# EAGLE schematic K019 (EAGLE 6.3), part 2 of 2
## Sheet 3 of 4
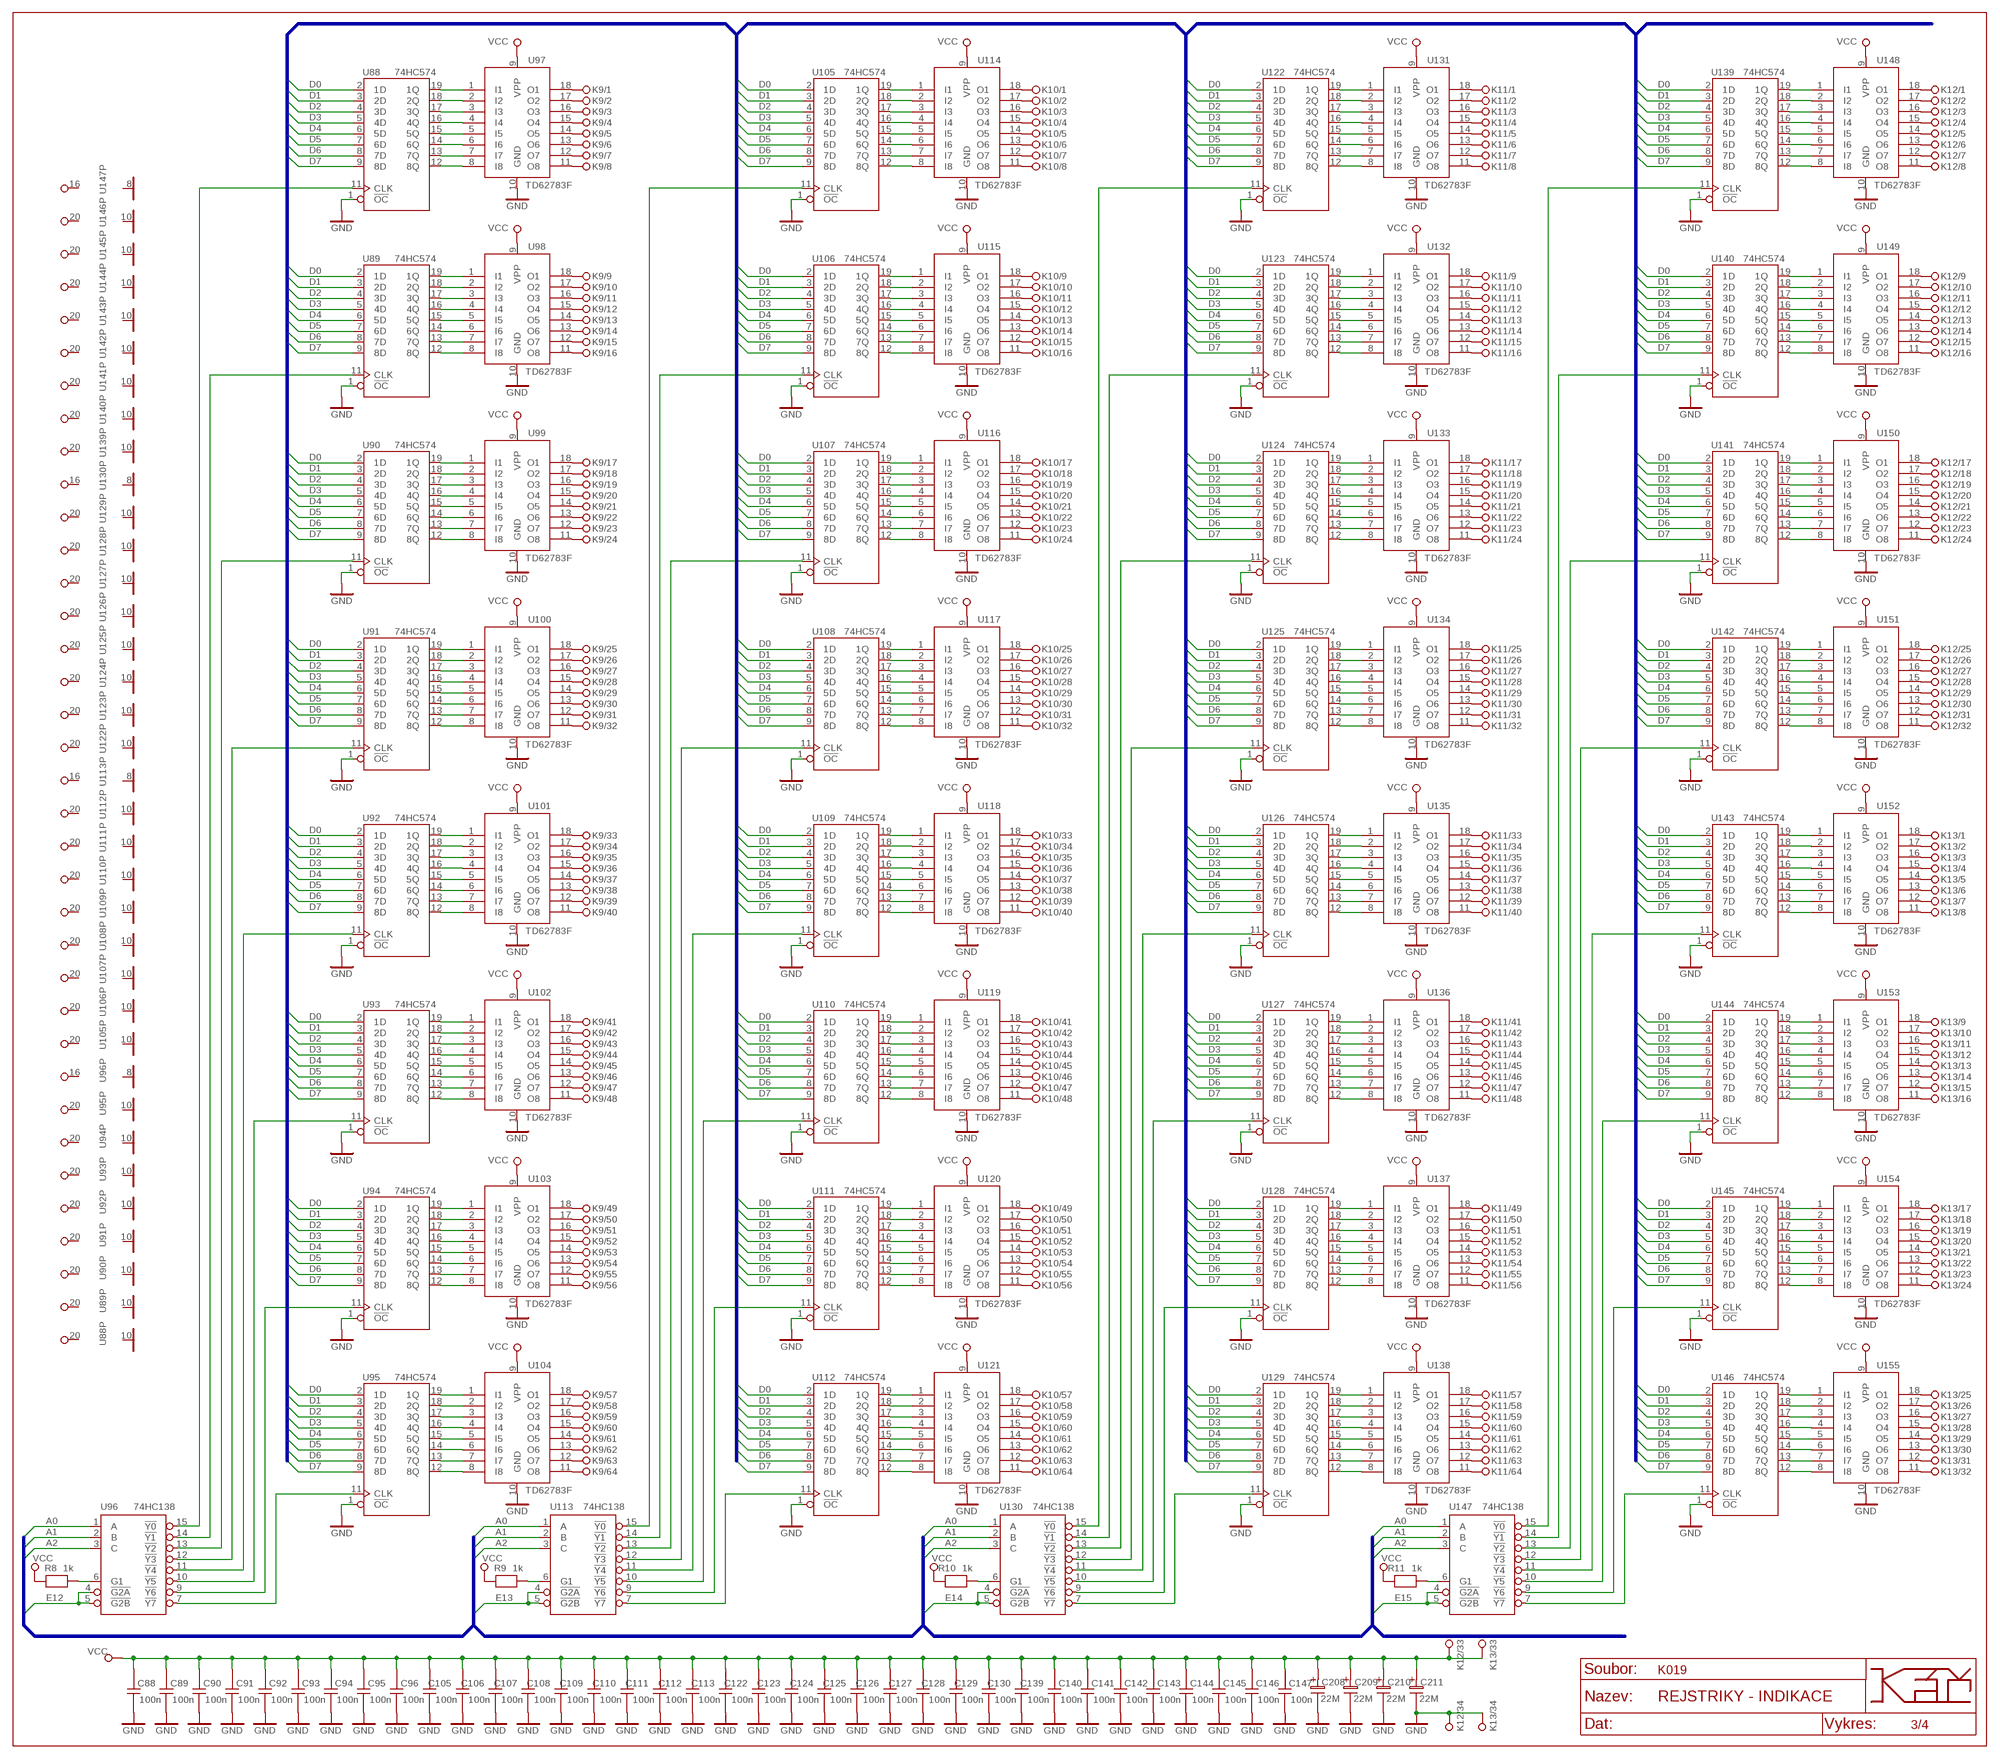
[diagram p3: schematic, sheet 3]

### Parts
C88  100n  C-5X8@2  [C-5-2X8]
C89  100n  C-5X8@2  [C-5-2X8]
C90  100n  C-5X8@2  [C-5-2X8]
C91  100n  C-5X8@2  [C-5-2X8]
C92  100n  C-5X8@2  [C-5-2X8]
C93  100n  C-5X8@2  [C-5-2X8]
C94  100n  C-5X8@2  [C-5-2X8]
C95  100n  C-5X8@2  [C-5-2X8]
C96  100n  C-5X8@2  [C-5-2X8]
C105  100n  C-5X8@2  [C-5-2X8]
C106  100n  C-5X8@2  [C-5-2X8]
C107  100n  C-5X8@2  [C-5-2X8]
C108  100n  C-5X8@2  [C-5-2X8]
C109  100n  C-5X8@2  [C-5-2X8]
C110  100n  C-5X8@2  [C-5-2X8]
C111  100n  C-5X8@2  [C-5-2X8]
C112  100n  C-5X8@2  [C-5-2X8]
C113  100n  C-5X8@2  [C-5-2X8]
C122  100n  C-5X8@2  [C-5-2X8]
C123  100n  C-5X8@2  [C-5-2X8]
C124  100n  C-5X8@2  [C-5-2X8]
C125  100n  C-5X8@2  [C-5-2X8]
C126  100n  C-5X8@2  [C-5-2X8]
C127  100n  C-5X8@2  [C-5-2X8]
C128  100n  C-5X8@2  [C-5-2X8]
C129  100n  C-5X8@2  [C-5-2X8]
C130  100n  C-5X8@2  [C-5-2X8]
C139  100n  C-5X8@2  [C-5-2X8]
C140  100n  C-5X8@2  [C-5-2X8]
C141  100n  C-5X8@2  [C-5-2X8]
C142  100n  C-5X8@2  [C-5-2X8]
C143  100n  C-5X8@2  [C-5-2X8]
C144  100n  C-5X8@2  [C-5-2X8]
C145  100n  C-5X8@2  [C-5-2X8]
C146  100n  C-5X8@2  [C-5-2X8]
C147  100n  C-5X8@2  [C-5-2X8]
C208  22M  EC-2/5  [EC-2/5]
C209  22M  EC-2/5  [EC-2/5]
C210  22M  EC-2/5  [EC-2/5]
C211  22M  EC-2/5  [EC-2/5]
K9  KON64  [KON64]
K10  KON64  [KON64]
K11  KON64  [KON64]
K12  KON34  [KON34]
K13  KON34  [KON34]
R8  1k  R-10-0,8@2  [R-7,5]
R9  1k  R-10-0,8@2  [R-7,5]
R10  1k  R-10-0,8@2  [R-7,5]
R11  1k  R-10-0,8@2  [R-7,5]
U88  74HC574  74AC574@2  [DIL20]
U89  74HC574  74AC574@2  [DIL20]
U90  74HC574  74AC574@2  [DIL20]
U91  74HC574  74AC574@2  [DIL20]
U92  74HC574  74AC574@2  [DIL20]
U93  74HC574  74AC574@2  [DIL20]
U94  74HC574  74AC574@2  [DIL20]
U95  74HC574  74AC574@2  [DIL20]
U96  74HC138  74AC138  [DIL16]
U97  TD62783F  TD62783F@2  [DIL18]
U98  TD62783F  TD62783F@2  [DIL18]
U99  TD62783F  TD62783F@2  [DIL18]
U100  TD62783F  TD62783F@2  [DIL18]
U101  TD62783F  TD62783F@2  [DIL18]
U102  TD62783F  TD62783F@2  [DIL18]
U103  TD62783F  TD62783F@2  [DIL18]
U104  TD62783F  TD62783F@2  [DIL18]
U105  74HC574  74AC574@2  [DIL20]
U106  74HC574  74AC574@2  [DIL20]
U107  74HC574  74AC574@2  [DIL20]
U108  74HC574  74AC574@2  [DIL20]
U109  74HC574  74AC574@2  [DIL20]
U110  74HC574  74AC574@2  [DIL20]
U111  74HC574  74AC574@2  [DIL20]
U112  74HC574  74AC574@2  [DIL20]
U113  74HC138  74AC138  [DIL16]
U114  TD62783F  TD62783F@2  [DIL18]
U115  TD62783F  TD62783F@2  [DIL18]
U116  TD62783F  TD62783F@2  [DIL18]
U117  TD62783F  TD62783F@2  [DIL18]
U118  TD62783F  TD62783F@2  [DIL18]
U119  TD62783F  TD62783F@2  [DIL18]
U120  TD62783F  TD62783F@2  [DIL18]
U121  TD62783F  TD62783F@2  [DIL18]
U122  74HC574  74AC574@2  [DIL20]
U123  74HC574  74AC574@2  [DIL20]
U124  74HC574  74AC574@2  [DIL20]
U125  74HC574  74AC574@2  [DIL20]
U126  74HC574  74AC574@2  [DIL20]
U127  74HC574  74AC574@2  [DIL20]
U128  74HC574  74AC574@2  [DIL20]
U129  74HC574  74AC574@2  [DIL20]
U130  74HC138  74AC138  [DIL16]
U131  TD62783F  TD62783F@2  [DIL18]
U132  TD62783F  TD62783F@2  [DIL18]
U133  TD62783F  TD62783F@2  [DIL18]
U134  TD62783F  TD62783F@2  [DIL18]
U135  TD62783F  TD62783F@2  [DIL18]
U136  TD62783F  TD62783F@2  [DIL18]
U137  TD62783F  TD62783F@2  [DIL18]
U138  TD62783F  TD62783F@2  [DIL18]
U139  74HC574  74AC574@2  [DIL20]
U140  74HC574  74AC574@2  [DIL20]
U141  74HC574  74AC574@2  [DIL20]
U142  74HC574  74AC574@2  [DIL20]
U143  74HC574  74AC574@2  [DIL20]
U144  74HC574  74AC574@2  [DIL20]
U145  74HC574  74AC574@2  [DIL20]
U146  74HC574  74AC574@2  [DIL20]
U147  74HC138  74AC138  [DIL16]
U148  TD62783F  TD62783F@2  [DIL18]
U149  TD62783F  TD62783F@2  [DIL18]
U150  TD62783F  TD62783F@2  [DIL18]
U151  TD62783F  TD62783F@2  [DIL18]
U152  TD62783F  TD62783F@2  [DIL18]
U153  TD62783F  TD62783F@2  [DIL18]
U154  TD62783F  TD62783F@2  [DIL18]
U155  TD62783F  TD62783F@2  [DIL18]

### Nets
A0: U96.1(A) U113.1(A) U130.1(A) U147.1(A) ; also sheet 1,2,4
A1: U96.2(B) U113.2(B) U130.2(B) U147.2(B) ; also sheet 1,2,4
A2: U96.3(C) U113.3(C) U130.3(C) U147.3(C) ; also sheet 1,2,4
D0: U88.2(1D) U89.2(1D) U90.2(1D) U91.2(1D) U92.2(1D) U93.2(1D) U94.2(1D) U95.2(1D) U105.2(1D) U106.2(1D) U107.2(1D) U108.2(1D) U109.2(1D) U110.2(1D) U111.2(1D) U112.2(1D) U122.2(1D) U123.2(1D) U124.2(1D) U125.2(1D) U126.2(1D) U127.2(1D) U128.2(1D) U129.2(1D) U139.2(1D) U140.2(1D) U141.2(1D) U142.2(1D) U143.2(1D) U144.2(1D) U145.2(1D) U146.2(1D) ; also sheet 1,2,4
D1: U88.3(2D) U89.3(2D) U90.3(2D) U91.3(2D) U92.3(2D) U93.3(2D) U94.3(2D) U95.3(2D) U105.3(2D) U106.3(2D) U107.3(2D) U108.3(2D) U109.3(2D) U110.3(2D) U111.3(2D) U112.3(2D) U122.3(2D) U123.3(2D) U124.3(2D) U125.3(2D) U126.3(2D) U127.3(2D) U128.3(2D) U129.3(2D) U139.3(2D) U140.3(2D) U141.3(2D) U142.3(2D) U143.3(2D) U144.3(2D) U145.3(2D) U146.3(2D) ; also sheet 1,2,4
D2: U88.4(3D) U89.4(3D) U90.4(3D) U91.4(3D) U92.4(3D) U93.4(3D) U94.4(3D) U95.4(3D) U105.4(3D) U106.4(3D) U107.4(3D) U108.4(3D) U109.4(3D) U110.4(3D) U111.4(3D) U112.4(3D) U122.4(3D) U123.4(3D) U124.4(3D) U125.4(3D) U126.4(3D) U127.4(3D) U128.4(3D) U129.4(3D) U139.4(3D) U140.4(3D) U141.4(3D) U142.4(3D) U143.4(3D) U144.4(3D) U145.4(3D) U146.4(3D) ; also sheet 1,2,4
D3: U88.5(4D) U89.5(4D) U90.5(4D) U91.5(4D) U92.5(4D) U93.5(4D) U94.5(4D) U95.5(4D) U105.5(4D) U106.5(4D) U107.5(4D) U108.5(4D) U109.5(4D) U110.5(4D) U111.5(4D) U112.5(4D) U122.5(4D) U123.5(4D) U124.5(4D) U125.5(4D) U126.5(4D) U127.5(4D) U128.5(4D) U129.5(4D) U139.5(4D) U140.5(4D) U141.5(4D) U142.5(4D) U143.5(4D) U144.5(4D) U145.5(4D) U146.5(4D) ; also sheet 1,2,4
D4: U88.6(5D) U89.6(5D) U90.6(5D) U91.6(5D) U92.6(5D) U93.6(5D) U94.6(5D) U95.6(5D) U105.6(5D) U106.6(5D) U107.6(5D) U108.6(5D) U109.6(5D) U110.6(5D) U111.6(5D) U112.6(5D) U122.6(5D) U123.6(5D) U124.6(5D) U125.6(5D) U126.6(5D) U127.6(5D) U128.6(5D) U129.6(5D) U139.6(5D) U140.6(5D) U141.6(5D) U142.6(5D) U143.6(5D) U144.6(5D) U145.6(5D) U146.6(5D) ; also sheet 1,2,4
D5: U88.7(6D) U89.7(6D) U90.7(6D) U91.7(6D) U92.7(6D) U93.7(6D) U94.7(6D) U95.7(6D) U105.7(6D) U106.7(6D) U107.7(6D) U108.7(6D) U109.7(6D) U110.7(6D) U111.7(6D) U112.7(6D) U122.7(6D) U123.7(6D) U124.7(6D) U125.7(6D) U126.7(6D) U127.7(6D) U128.7(6D) U129.7(6D) U139.7(6D) U140.7(6D) U141.7(6D) U142.7(6D) U143.7(6D) U144.7(6D) U145.7(6D) U146.7(6D) ; also sheet 1,2,4
D6: U88.8(7D) U89.8(7D) U90.8(7D) U91.8(7D) U92.8(7D) U93.8(7D) U94.8(7D) U95.8(7D) U105.8(7D) U106.8(7D) U107.8(7D) U108.8(7D) U109.8(7D) U110.8(7D) U111.8(7D) U112.8(7D) U122.8(7D) U123.8(7D) U124.8(7D) U125.8(7D) U126.8(7D) U127.8(7D) U128.8(7D) U129.8(7D) U139.8(7D) U140.8(7D) U141.8(7D) U142.8(7D) U143.8(7D) U144.8(7D) U145.8(7D) U146.8(7D) ; also sheet 1,2,4
D7: U88.9(8D) U89.9(8D) U90.9(8D) U91.9(8D) U92.9(8D) U93.9(8D) U94.9(8D) U95.9(8D) U105.9(8D) U106.9(8D) U107.9(8D) U108.9(8D) U109.9(8D) U110.9(8D) U111.9(8D) U112.9(8D) U122.9(8D) U123.9(8D) U124.9(8D) U125.9(8D) U126.9(8D) U127.9(8D) U128.9(8D) U129.9(8D) U139.9(8D) U140.9(8D) U141.9(8D) U142.9(8D) U143.9(8D) U144.9(8D) U145.9(8D) U146.9(8D) ; also sheet 1,2,4
E12: U96.4(!G2A) U96.5(!G2B) ; also sheet 4
E13: U113.4(!G2A) U113.5(!G2B) ; also sheet 4
E14: U130.4(!G2A) U130.5(!G2B) ; also sheet 4
E15: U147.4(!G2A) U147.5(!G2B) ; also sheet 4
GND: C88.1 C89.1 C90.1 C91.1 C92.1 C93.1 C94.1 C95.1 C96.1 C105.1 C106.1 C107.1 C108.1 C109.1 C110.1 C111.1 C112.1 C113.1 C122.1 C123.1 C124.1 C125.1 C126.1 C127.1 C128.1 C129.1 C130.1 C139.1 C140.1 C141.1 C142.1 C143.1 C144.1 C145.1 C146.1 C147.1 C208.1 C209.1 C210.1 C211.1 K12.34 K13.34 U88.1(!OC) U89.1(!OC) U90.1(!OC) U91.1(!OC) U92.1(!OC) U93.1(!OC) U94.1(!OC) U95.1(!OC) U97.10(GND) U98.10(GND) U99.10(GND) U100.10(GND) U101.10(GND) U102.10(GND) U103.10(GND) U104.10(GND) U105.1(!OC) U106.1(!OC) U107.1(!OC) U108.1(!OC) U109.1(!OC) U110.1(!OC) U111.1(!OC) U112.1(!OC) U114.10(GND) U115.10(GND) U116.10(GND) U117.10(GND) U118.10(GND) U119.10(GND) U120.10(GND) U121.10(GND) U122.1(!OC) U123.1(!OC) U124.1(!OC) U125.1(!OC) U126.1(!OC) U127.1(!OC) U128.1(!OC) U129.1(!OC) U131.10(GND) U132.10(GND) U133.10(GND) U134.10(GND) U135.10(GND) U136.10(GND) U137.10(GND) U138.10(GND) U139.1(!OC) U140.1(!OC) U141.1(!OC) U142.1(!OC) U143.1(!OC) U144.1(!OC) U145.1(!OC) U146.1(!OC) U148.10(GND) U149.10(GND) U150.10(GND) U151.10(GND) U152.10(GND) U153.10(GND) U154.10(GND) U155.10(GND) ; also sheet 1,2,4
N$704: U88.19(1Q) U97.1(I1)
N$705: U88.18(2Q) U97.2(I2)
N$706: U88.17(3Q) U97.3(I3)
N$707: U88.16(4Q) U97.4(I4)
N$708: U88.15(5Q) U97.5(I5)
N$709: U88.14(6Q) U97.6(I6)
N$710: U88.13(7Q) U97.7(I7)
N$711: U88.12(8Q) U97.8(I8)
N$712: U89.19(1Q) U98.1(I1)
N$713: K9.1 U97.18(O1)
N$714: K9.2 U97.17(O2)
N$715: U89.18(2Q) U98.2(I2)
N$716: U89.17(3Q) U98.3(I3)
N$717: U89.16(4Q) U98.4(I4)
N$718: U89.15(5Q) U98.5(I5)
N$719: U89.14(6Q) U98.6(I6)
N$720: U89.13(7Q) U98.7(I7)
N$721: U89.12(8Q) U98.8(I8)
N$722: K9.3 U97.16(O3)
N$723: U90.19(1Q) U99.1(I1)
N$724: U90.18(2Q) U99.2(I2)
N$725: U90.17(3Q) U99.3(I3)
N$726: U90.16(4Q) U99.4(I4)
N$727: U90.15(5Q) U99.5(I5)
N$728: U90.14(6Q) U99.6(I6)
N$729: U90.13(7Q) U99.7(I7)
N$730: U90.12(8Q) U99.8(I8)
N$731: K9.4 U97.15(O4)
N$732: U91.19(1Q) U100.1(I1)
N$733: U91.18(2Q) U100.2(I2)
N$734: U91.17(3Q) U100.3(I3)
N$735: U91.16(4Q) U100.4(I4)
N$736: U91.15(5Q) U100.5(I5)
N$737: U91.12(8Q) U100.8(I8)
N$738: U91.13(7Q) U100.7(I7)
N$739: U91.14(6Q) U100.6(I6)
N$740: K9.5 U97.14(O5)
N$741: U92.19(1Q) U101.1(I1)
N$742: U92.18(2Q) U101.2(I2)
N$743: U92.17(3Q) U101.3(I3)
N$744: U92.16(4Q) U101.4(I4)
N$745: U92.15(5Q) U101.5(I5)
N$746: U92.14(6Q) U101.6(I6)
N$747: U92.13(7Q) U101.7(I7)
N$748: U92.12(8Q) U101.8(I8)
N$749: K9.6 U97.13(O6)
N$750: U93.19(1Q) U102.1(I1)
N$751: U93.18(2Q) U102.2(I2)
N$752: U93.17(3Q) U102.3(I3)
N$753: U93.16(4Q) U102.4(I4)
N$754: U93.15(5Q) U102.5(I5)
N$755: U93.14(6Q) U102.6(I6)
N$756: U93.13(7Q) U102.7(I7)
N$757: U93.12(8Q) U102.8(I8)
N$758: U94.19(1Q) U103.1(I1)
N$759: U94.18(2Q) U103.2(I2)
N$760: U94.17(3Q) U103.3(I3)
N$761: U94.16(4Q) U103.4(I4)
N$762: U94.15(5Q) U103.5(I5)
N$763: U94.14(6Q) U103.6(I6)
N$764: U94.13(7Q) U103.7(I7)
N$765: U94.12(8Q) U103.8(I8)
N$766: U95.19(1Q) U104.1(I1)
N$767: U95.18(2Q) U104.2(I2)
N$768: K9.7 U97.12(O7)
N$769: K9.8 U97.11(O8)
N$770: U95.17(3Q) U104.3(I3)
N$771: U95.16(4Q) U104.4(I4)
N$772: U95.15(5Q) U104.5(I5)
N$773: U95.14(6Q) U104.6(I6)
N$774: U95.13(7Q) U104.7(I7)
N$775: U95.12(8Q) U104.8(I8)
N$776: K9.9 U98.18(O1)
N$777: K9.10 U98.17(O2)
N$778: K9.11 U98.16(O3)
N$779: K9.12 U98.15(O4)
N$780: K9.13 U98.14(O5)
N$781: K9.14 U98.13(O6)
N$782: K9.15 U98.12(O7)
N$783: K9.16 U98.11(O8)
N$784: K9.17 U99.18(O1)
N$785: K9.18 U99.17(O2)
N$786: K9.19 U99.16(O3)
N$787: K9.20 U99.15(O4)
N$788: K9.21 U99.14(O5)
N$789: K9.22 U99.13(O6)
N$790: K9.23 U99.12(O7)
N$791: K9.24 U99.11(O8)
N$792: K9.25 U100.18(O1)
N$793: K9.26 U100.17(O2)
N$794: K9.27 U100.16(O3)
N$795: K9.28 U100.15(O4)
N$796: K9.29 U100.14(O5)
N$797: K9.30 U100.13(O6)
N$798: K9.31 U100.12(O7)
N$799: K9.32 U100.11(O8)
N$800: K9.33 U101.18(O1)
N$801: K9.34 U101.17(O2)
N$802: K9.35 U101.16(O3)
N$803: K9.36 U101.15(O4)
N$804: K9.37 U101.14(O5)
N$805: K9.38 U101.13(O6)
N$806: K9.39 U101.12(O7)
N$807: K9.40 U101.11(O8)
N$808: K9.41 U102.18(O1)
N$809: K9.42 U102.17(O2)
N$810: K9.43 U102.16(O3)
N$811: K9.44 U102.15(O4)
N$812: K9.45 U102.14(O5)
N$813: K9.46 U102.13(O6)
N$814: K9.47 U102.12(O7)
N$815: K9.48 U102.11(O8)
N$816: K9.49 U103.18(O1)
N$817: K9.50 U103.17(O2)
N$818: K9.51 U103.16(O3)
N$819: K9.52 U103.15(O4)
N$820: K9.53 U103.14(O5)
N$821: K9.54 U103.13(O6)
N$822: K9.55 U103.12(O7)
N$823: K9.56 U103.11(O8)
N$824: K9.57 U104.18(O1)
N$825: K9.58 U104.17(O2)
N$826: K9.59 U104.16(O3)
N$827: K9.60 U104.15(O4)
N$828: K9.61 U104.14(O5)
N$829: K9.62 U104.13(O6)
N$830: K9.63 U104.12(O7)
N$831: K9.64 U104.11(O8)
N$832: U94.11(CLK) U96.9(!Y6)
N$833: U93.11(CLK) U96.10(!Y5)
N$834: U92.11(CLK) U96.11(!Y4)
N$835: U91.11(CLK) U96.12(!Y3)
N$836: U90.11(CLK) U96.13(!Y2)
N$837: U89.11(CLK) U96.14(!Y1)
N$838: U88.11(CLK) U96.15(!Y0)
N$839: U95.11(CLK) U96.7(!Y7)
N$840: R8.2 U96.6(G1)
N$841: U111.11(CLK) U113.9(!Y6)
N$842: U110.11(CLK) U113.10(!Y5)
N$843: U109.11(CLK) U113.11(!Y4)
N$844: U108.11(CLK) U113.12(!Y3)
N$845: U107.11(CLK) U113.13(!Y2)
N$846: U106.11(CLK) U113.14(!Y1)
N$847: U105.11(CLK) U113.15(!Y0)
N$848: U112.11(CLK) U113.7(!Y7)
N$849: R9.2 U113.6(G1)
N$850: U105.19(1Q) U114.1(I1)
N$851: U105.18(2Q) U114.2(I2)
N$852: U105.17(3Q) U114.3(I3)
N$853: U105.16(4Q) U114.4(I4)
N$854: U105.15(5Q) U114.5(I5)
N$855: U105.14(6Q) U114.6(I6)
N$856: U105.13(7Q) U114.7(I7)
N$857: U105.12(8Q) U114.8(I8)
N$858: U106.19(1Q) U115.1(I1)
N$859: U106.18(2Q) U115.2(I2)
N$860: U106.17(3Q) U115.3(I3)
N$861: U106.16(4Q) U115.4(I4)
N$862: U106.15(5Q) U115.5(I5)
N$863: U106.14(6Q) U115.6(I6)
N$864: U106.13(7Q) U115.7(I7)
N$865: U106.12(8Q) U115.8(I8)
N$866: U107.19(1Q) U116.1(I1)
N$867: U107.18(2Q) U116.2(I2)
N$868: U107.17(3Q) U116.3(I3)
N$869: U107.16(4Q) U116.4(I4)
N$870: U107.15(5Q) U116.5(I5)
N$871: U107.14(6Q) U116.6(I6)
N$872: U107.13(7Q) U116.7(I7)
N$873: U107.12(8Q) U116.8(I8)
N$874: U108.19(1Q) U117.1(I1)
N$875: U108.18(2Q) U117.2(I2)
N$876: U108.17(3Q) U117.3(I3)
N$877: U108.16(4Q) U117.4(I4)
N$878: U108.15(5Q) U117.5(I5)
N$879: U108.14(6Q) U117.6(I6)
N$880: U108.13(7Q) U117.7(I7)
N$881: U108.12(8Q) U117.8(I8)
N$882: U109.19(1Q) U118.1(I1)
N$883: U109.18(2Q) U118.2(I2)
N$884: U109.17(3Q) U118.3(I3)
N$885: U109.16(4Q) U118.4(I4)
N$886: U109.15(5Q) U118.5(I5)
N$887: U109.14(6Q) U118.6(I6)
N$888: U109.13(7Q) U118.7(I7)
N$889: U109.12(8Q) U118.8(I8)
N$890: U110.19(1Q) U119.1(I1)
N$891: U110.18(2Q) U119.2(I2)
N$892: U110.17(3Q) U119.3(I3)
N$893: U110.16(4Q) U119.4(I4)
N$894: U110.15(5Q) U119.5(I5)
N$895: U110.14(6Q) U119.6(I6)
N$896: U110.13(7Q) U119.7(I7)
N$897: U110.12(8Q) U119.8(I8)
N$898: U111.19(1Q) U120.1(I1)
N$899: U111.18(2Q) U120.2(I2)
N$900: U111.17(3Q) U120.3(I3)
N$901: U111.16(4Q) U120.4(I4)
N$902: U111.15(5Q) U120.5(I5)
N$903: U111.14(6Q) U120.6(I6)
N$904: U111.13(7Q) U120.7(I7)
N$905: U111.12(8Q) U120.8(I8)
N$906: U112.19(1Q) U121.1(I1)
N$907: U112.18(2Q) U121.2(I2)
N$908: U112.17(3Q) U121.3(I3)
N$909: U112.16(4Q) U121.4(I4)
N$910: U112.15(5Q) U121.5(I5)
N$911: U112.14(6Q) U121.6(I6)
N$912: U112.13(7Q) U121.7(I7)
N$913: U112.12(8Q) U121.8(I8)
N$914: K10.1 U114.18(O1)
N$915: K10.2 U114.17(O2)
N$916: K10.3 U114.16(O3)
N$917: K10.4 U114.15(O4)
N$918: K10.5 U114.14(O5)
N$919: K10.6 U114.13(O6)
N$920: K10.7 U114.12(O7)
N$921: K10.8 U114.11(O8)
N$922: K10.9 U115.18(O1)
N$923: K10.10 U115.17(O2)
N$924: K10.11 U115.16(O3)
N$925: K10.12 U115.15(O4)
N$926: K10.13 U115.14(O5)
N$927: K10.14 U115.13(O6)
N$928: K10.15 U115.12(O7)
N$929: K10.16 U115.11(O8)
N$930: K10.17 U116.18(O1)
N$931: K10.18 U116.17(O2)
N$932: K10.19 U116.16(O3)
N$933: K10.20 U116.15(O4)
N$934: K10.21 U116.14(O5)
N$935: K10.22 U116.13(O6)
N$936: K10.23 U116.12(O7)
N$937: K10.24 U116.11(O8)
N$938: K10.25 U117.18(O1)
N$939: K10.26 U117.17(O2)
N$940: K10.27 U117.16(O3)
N$941: K10.28 U117.15(O4)
N$942: K10.29 U117.14(O5)
N$943: K10.30 U117.13(O6)
N$944: K10.31 U117.12(O7)
N$945: K10.32 U117.11(O8)
N$946: K10.33 U118.18(O1)
N$947: K10.34 U118.17(O2)
N$948: K10.35 U118.16(O3)
N$949: K10.36 U118.15(O4)
N$950: K10.37 U118.14(O5)
N$951: K10.38 U118.13(O6)
N$952: K10.39 U118.12(O7)
N$953: K10.40 U118.11(O8)
N$954: K10.41 U119.18(O1)
N$955: K10.42 U119.17(O2)
N$956: K10.43 U119.16(O3)
N$957: K10.44 U119.15(O4)
N$958: K10.45 U119.14(O5)
N$959: K10.46 U119.13(O6)
N$960: K10.47 U119.12(O7)
N$961: K10.48 U119.11(O8)
N$962: K10.49 U120.18(O1)
N$963: K10.50 U120.17(O2)
N$964: K10.51 U120.16(O3)
N$965: K10.52 U120.15(O4)
N$966: K10.53 U120.14(O5)
N$967: K10.54 U120.13(O6)
N$968: K10.55 U120.12(O7)
N$969: K10.56 U120.11(O8)
N$970: K10.57 U121.18(O1)
N$971: K10.58 U121.17(O2)
N$972: K10.59 U121.16(O3)
N$973: K10.60 U121.15(O4)
N$974: K10.61 U121.14(O5)
N$975: K10.62 U121.13(O6)
N$976: K10.63 U121.12(O7)
N$977: K10.64 U121.11(O8)
N$978: U128.11(CLK) U130.9(!Y6)
N$979: U127.11(CLK) U130.10(!Y5)
N$980: U126.11(CLK) U130.11(!Y4)
N$981: U125.11(CLK) U130.12(!Y3)
N$982: U124.11(CLK) U130.13(!Y2)
N$983: U123.11(CLK) U130.14(!Y1)
N$984: U122.11(CLK) U130.15(!Y0)
N$985: U129.11(CLK) U130.7(!Y7)
N$986: R10.2 U130.6(G1)
N$987: U122.19(1Q) U131.1(I1)
N$988: U122.18(2Q) U131.2(I2)
N$989: U122.17(3Q) U131.3(I3)
N$990: U122.16(4Q) U131.4(I4)
N$991: U122.15(5Q) U131.5(I5)
N$992: U122.14(6Q) U131.6(I6)
N$993: U122.13(7Q) U131.7(I7)
N$994: U122.12(8Q) U131.8(I8)
N$995: U123.19(1Q) U132.1(I1)
N$996: U123.18(2Q) U132.2(I2)
N$997: U123.17(3Q) U132.3(I3)
N$998: U123.16(4Q) U132.4(I4)
N$999: U123.15(5Q) U132.5(I5)
N$1000: U123.14(6Q) U132.6(I6)
N$1001: U123.13(7Q) U132.7(I7)
N$1002: U123.12(8Q) U132.8(I8)
N$1003: U124.19(1Q) U133.1(I1)
N$1004: U124.18(2Q) U133.2(I2)
N$1005: U124.17(3Q) U133.3(I3)
N$1006: U124.16(4Q) U133.4(I4)
N$1007: U124.15(5Q) U133.5(I5)
N$1008: U124.14(6Q) U133.6(I6)
N$1009: U124.13(7Q) U133.7(I7)
N$1010: U124.12(8Q) U133.8(I8)
N$1011: U125.19(1Q) U134.1(I1)
N$1012: U125.18(2Q) U134.2(I2)
N$1013: U125.17(3Q) U134.3(I3)
N$1014: U125.16(4Q) U134.4(I4)
N$1015: U125.15(5Q) U134.5(I5)
N$1016: U125.14(6Q) U134.6(I6)
N$1017: U125.13(7Q) U134.7(I7)
N$1018: U125.12(8Q) U134.8(I8)
N$1019: U126.19(1Q) U135.1(I1)
N$1020: U126.18(2Q) U135.2(I2)
N$1021: U126.17(3Q) U135.3(I3)
N$1022: U126.16(4Q) U135.4(I4)
N$1023: U126.15(5Q) U135.5(I5)
N$1024: U126.14(6Q) U135.6(I6)
N$1025: U126.13(7Q) U135.7(I7)
N$1026: U126.12(8Q) U135.8(I8)
N$1027: U127.19(1Q) U136.1(I1)
N$1028: U127.18(2Q) U136.2(I2)
N$1029: U127.17(3Q) U136.3(I3)
N$1030: U127.16(4Q) U136.4(I4)
N$1031: U127.15(5Q) U136.5(I5)
N$1032: U127.14(6Q) U136.6(I6)
N$1033: U127.13(7Q) U136.7(I7)
N$1034: U127.12(8Q) U136.8(I8)
N$1035: U128.19(1Q) U137.1(I1)
N$1036: U128.18(2Q) U137.2(I2)
N$1037: U128.17(3Q) U137.3(I3)
N$1038: U128.16(4Q) U137.4(I4)
N$1039: U128.15(5Q) U137.5(I5)
N$1040: U128.14(6Q) U137.6(I6)
N$1041: U128.13(7Q) U137.7(I7)
N$1042: U128.12(8Q) U137.8(I8)
N$1043: U129.19(1Q) U138.1(I1)
N$1044: U129.18(2Q) U138.2(I2)
N$1045: U129.17(3Q) U138.3(I3)
N$1046: U129.16(4Q) U138.4(I4)
N$1047: U129.15(5Q) U138.5(I5)
N$1048: U129.14(6Q) U138.6(I6)
N$1049: U129.13(7Q) U138.7(I7)
N$1050: U129.12(8Q) U138.8(I8)
N$1051: K11.1 U131.18(O1)
N$1052: K11.2 U131.17(O2)
N$1053: K11.3 U131.16(O3)
N$1054: K11.4 U131.15(O4)
N$1055: K11.5 U131.14(O5)
N$1056: K11.6 U131.13(O6)
N$1057: K11.7 U131.12(O7)
N$1058: K11.8 U131.11(O8)
N$1059: K11.9 U132.18(O1)
N$1060: K11.10 U132.17(O2)
N$1061: K11.11 U132.16(O3)
N$1062: K11.12 U132.15(O4)
N$1063: K11.13 U132.14(O5)
N$1064: K11.14 U132.13(O6)
N$1065: K11.15 U132.12(O7)
N$1066: K11.16 U132.11(O8)
N$1067: K11.17 U133.18(O1)
N$1068: K11.18 U133.17(O2)
N$1069: K11.19 U133.16(O3)
N$1070: K11.20 U133.15(O4)
N$1071: K11.21 U133.14(O5)
N$1072: K11.22 U133.13(O6)
N$1073: K11.23 U133.12(O7)
N$1074: K11.24 U133.11(O8)
N$1075: K11.25 U134.18(O1)
N$1076: K11.26 U134.17(O2)
N$1077: K11.27 U134.16(O3)
N$1078: K11.28 U134.15(O4)
N$1079: K11.29 U134.14(O5)
N$1080: K11.30 U134.13(O6)
N$1081: K11.31 U134.12(O7)
N$1082: K11.32 U134.11(O8)
N$1083: K11.33 U135.18(O1)
N$1084: K11.34 U135.17(O2)
N$1085: K11.35 U135.16(O3)
N$1086: K11.36 U135.15(O4)
N$1087: K11.37 U135.14(O5)
N$1088: K11.38 U135.13(O6)
N$1089: K11.39 U135.12(O7)
N$1090: K11.40 U135.11(O8)
N$1091: K11.41 U136.18(O1)
N$1092: K11.42 U136.17(O2)
N$1093: K11.43 U136.16(O3)
N$1094: K11.44 U136.15(O4)
N$1095: K11.45 U136.14(O5)
N$1096: K11.46 U136.13(O6)
N$1097: K11.47 U136.12(O7)
N$1098: K11.48 U136.11(O8)
N$1099: K11.49 U137.18(O1)
N$1100: K11.50 U137.17(O2)
N$1101: K11.51 U137.16(O3)
N$1102: K11.52 U137.15(O4)
N$1103: K11.53 U137.14(O5)
N$1104: K11.54 U137.13(O6)
N$1105: K11.55 U137.12(O7)
N$1106: K11.56 U137.11(O8)
N$1107: K11.57 U138.18(O1)
N$1108: K11.58 U138.17(O2)
N$1109: K11.59 U138.16(O3)
N$1110: K11.60 U138.15(O4)
N$1111: K11.61 U138.14(O5)
N$1112: K11.62 U138.13(O6)
N$1113: K11.63 U138.12(O7)
N$1114: K11.64 U138.11(O8)
N$1115: U145.11(CLK) U147.9(!Y6)
N$1116: U144.11(CLK) U147.10(!Y5)
N$1117: U143.11(CLK) U147.11(!Y4)
N$1118: U142.11(CLK) U147.12(!Y3)
N$1119: U141.11(CLK) U147.13(!Y2)
N$1120: U140.11(CLK) U147.14(!Y1)
N$1121: U139.11(CLK) U147.15(!Y0)
N$1122: U146.11(CLK) U147.7(!Y7)
N$1123: R11.2 U147.6(G1)
N$1124: U139.19(1Q) U148.1(I1)
N$1125: U139.18(2Q) U148.2(I2)
N$1126: U139.17(3Q) U148.3(I3)
N$1127: U139.16(4Q) U148.4(I4)
N$1128: U139.15(5Q) U148.5(I5)
N$1129: U139.14(6Q) U148.6(I6)
N$1130: U139.13(7Q) U148.7(I7)
N$1131: U139.12(8Q) U148.8(I8)
N$1132: U140.19(1Q) U149.1(I1)
N$1133: U140.18(2Q) U149.2(I2)
N$1134: U140.17(3Q) U149.3(I3)
N$1135: U140.16(4Q) U149.4(I4)
N$1136: U140.15(5Q) U149.5(I5)
N$1137: U140.14(6Q) U149.6(I6)
N$1138: U140.13(7Q) U149.7(I7)
N$1139: U140.12(8Q) U149.8(I8)
N$1140: U141.19(1Q) U150.1(I1)
N$1141: U141.18(2Q) U150.2(I2)
N$1142: U141.17(3Q) U150.3(I3)
N$1143: U141.16(4Q) U150.4(I4)
N$1144: U141.15(5Q) U150.5(I5)
N$1145: U141.14(6Q) U150.6(I6)
N$1146: U141.13(7Q) U150.7(I7)
N$1147: U141.12(8Q) U150.8(I8)
N$1148: U142.19(1Q) U151.1(I1)
N$1149: U142.18(2Q) U151.2(I2)
N$1150: U142.17(3Q) U151.3(I3)
N$1151: U142.16(4Q) U151.4(I4)
N$1152: U142.15(5Q) U151.5(I5)
N$1153: U142.14(6Q) U151.6(I6)
N$1154: U142.13(7Q) U151.7(I7)
N$1155: U142.12(8Q) U151.8(I8)
N$1156: U143.19(1Q) U152.1(I1)
N$1157: U143.18(2Q) U152.2(I2)
N$1158: U143.17(3Q) U152.3(I3)
N$1159: U143.16(4Q) U152.4(I4)
N$1160: U143.15(5Q) U152.5(I5)
N$1161: U143.14(6Q) U152.6(I6)
N$1162: U143.13(7Q) U152.7(I7)
N$1163: U143.12(8Q) U152.8(I8)
N$1164: U144.19(1Q) U153.1(I1)
N$1165: U144.18(2Q) U153.2(I2)
N$1166: U144.17(3Q) U153.3(I3)
N$1167: U144.16(4Q) U153.4(I4)
N$1168: U144.15(5Q) U153.5(I5)
N$1169: U144.14(6Q) U153.6(I6)
N$1170: U144.13(7Q) U153.7(I7)
N$1171: U144.12(8Q) U153.8(I8)
N$1172: U145.19(1Q) U154.1(I1)
N$1173: U145.18(2Q) U154.2(I2)
N$1174: U145.17(3Q) U154.3(I3)
N$1175: U145.16(4Q) U154.4(I4)
N$1176: U145.15(5Q) U154.5(I5)
N$1177: U145.14(6Q) U154.6(I6)
N$1178: U145.13(7Q) U154.7(I7)
N$1179: U145.12(8Q) U154.8(I8)
N$1180: U146.19(1Q) U155.1(I1)
N$1181: U146.18(2Q) U155.2(I2)
N$1182: U146.17(3Q) U155.3(I3)
N$1183: U146.16(4Q) U155.4(I4)
N$1184: U146.15(5Q) U155.5(I5)
N$1185: U146.14(6Q) U155.6(I6)
N$1186: U146.13(7Q) U155.7(I7)
N$1187: U146.12(8Q) U155.8(I8)
N$1188: K12.1 U148.18(O1)
N$1189: K12.2 U148.17(O2)
N$1190: K12.3 U148.16(O3)
N$1191: K12.4 U148.15(O4)
N$1192: K12.5 U148.14(O5)
N$1193: K12.6 U148.13(O6)
N$1194: K12.7 U148.12(O7)
N$1195: K12.8 U148.11(O8)
N$1196: K12.9 U149.18(O1)
N$1197: K12.10 U149.17(O2)
N$1198: K12.11 U149.16(O3)
N$1199: K12.12 U149.15(O4)
N$1200: K12.13 U149.14(O5)
N$1201: K12.14 U149.13(O6)
N$1202: K12.15 U149.12(O7)
N$1203: K12.16 U149.11(O8)
N$1204: K12.17 U150.18(O1)
N$1205: K12.18 U150.17(O2)
N$1206: K12.19 U150.16(O3)
N$1207: K12.20 U150.15(O4)
N$1208: K12.21 U150.14(O5)
N$1209: K12.22 U150.13(O6)
N$1210: K12.23 U150.12(O7)
N$1211: K12.24 U150.11(O8)
N$1212: K12.25 U151.18(O1)
N$1213: K12.26 U151.17(O2)
N$1214: K12.27 U151.16(O3)
N$1215: K12.28 U151.15(O4)
N$1216: K12.29 U151.14(O5)
N$1217: K12.30 U151.13(O6)
N$1218: K12.31 U151.12(O7)
N$1219: K12.32 U151.11(O8)
N$1220: K13.1 U152.18(O1)
N$1221: K13.2 U152.17(O2)
N$1222: K13.3 U152.16(O3)
N$1223: K13.4 U152.15(O4)
N$1224: K13.5 U152.14(O5)
N$1225: K13.6 U152.13(O6)
N$1226: K13.7 U152.12(O7)
N$1227: K13.8 U152.11(O8)
N$1228: K13.9 U153.18(O1)
N$1229: K13.10 U153.17(O2)
N$1230: K13.11 U153.16(O3)
N$1231: K13.12 U153.15(O4)
N$1232: K13.13 U153.14(O5)
N$1233: K13.14 U153.13(O6)
N$1234: K13.15 U153.12(O7)
N$1235: K13.16 U153.11(O8)
N$1236: K13.17 U154.18(O1)
N$1237: K13.18 U154.17(O2)
N$1238: K13.19 U154.16(O3)
N$1239: K13.20 U154.15(O4)
N$1240: K13.21 U154.14(O5)
N$1241: K13.22 U154.13(O6)
N$1242: K13.23 U154.12(O7)
N$1243: K13.24 U154.11(O8)
N$1244: K13.25 U155.18(O1)
N$1245: K13.26 U155.17(O2)
N$1246: K13.27 U155.16(O3)
N$1247: K13.28 U155.15(O4)
N$1248: K13.29 U155.14(O5)
N$1249: K13.30 U155.13(O6)
N$1250: K13.31 U155.12(O7)
N$1251: K13.32 U155.11(O8)
VCC: C88.2 C89.2 C90.2 C91.2 C92.2 C93.2 C94.2 C95.2 C96.2 C105.2 C106.2 C107.2 C108.2 C109.2 C110.2 C111.2 C112.2 C113.2 C122.2 C123.2 C124.2 C125.2 C126.2 C127.2 C128.2 C129.2 C130.2 C139.2 C140.2 C141.2 C142.2 C143.2 C144.2 C145.2 C146.2 C147.2 C208.2 C209.2 C210.2 C211.2 K12.33 K13.33 R8.1 R9.1 R10.1 R11.1 U97.9(VPP) U98.9(VPP) U99.9(VPP) U100.9(VPP) U101.9(VPP) U102.9(VPP) U103.9(VPP) U104.9(VPP) U114.9(VPP) U115.9(VPP) U116.9(VPP) U117.9(VPP) U118.9(VPP) U119.9(VPP) U120.9(VPP) U121.9(VPP) U131.9(VPP) U132.9(VPP) U133.9(VPP) U134.9(VPP) U135.9(VPP) U136.9(VPP) U137.9(VPP) U138.9(VPP) U148.9(VPP) U149.9(VPP) U150.9(VPP) U151.9(VPP) U152.9(VPP) U153.9(VPP) U154.9(VPP) U155.9(VPP) ; also sheet 1,2,4

### Buses
D[0..7]
A[0..5],E[0..15],IL,OL

### Notes on the sheet
- REJSTRIKY - INDIKACE

## Sheet 4 of 4
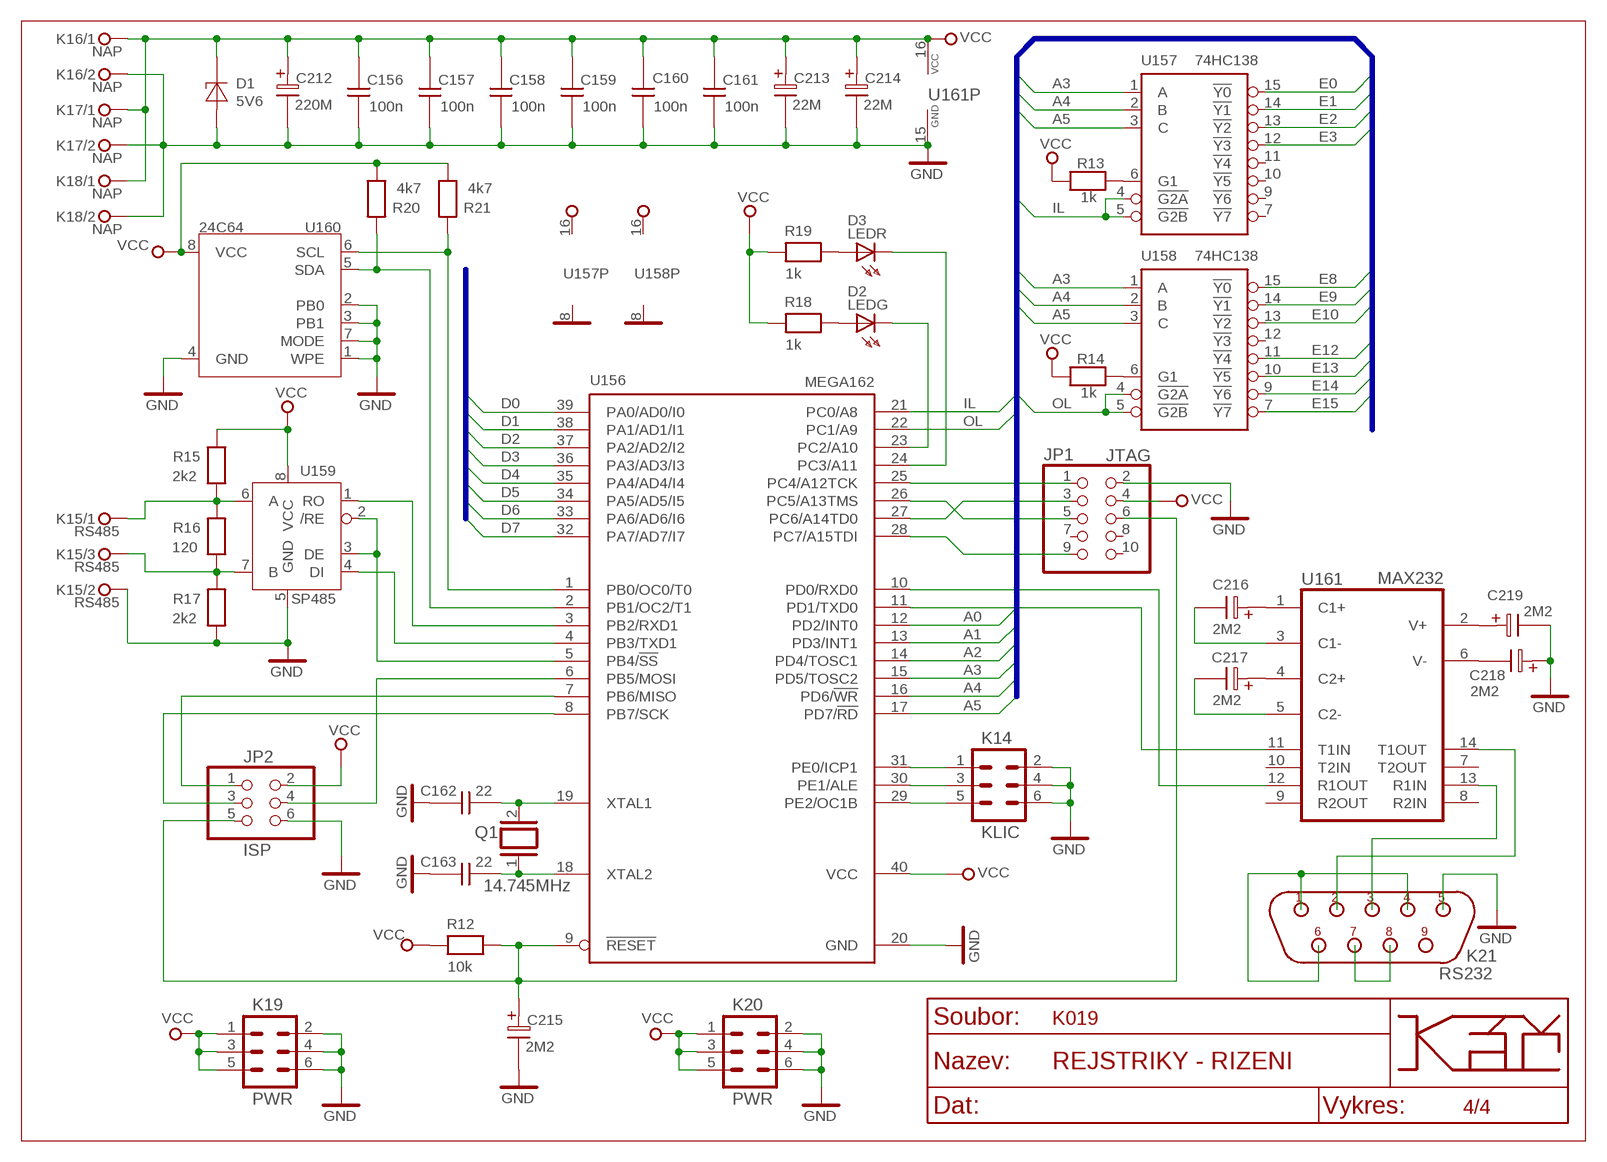
[diagram p4: schematic, sheet 4]

### Parts
C156  100n  C-5X8@2  [C-5-2X8]
C157  100n  C-5X8@2  [C-5-2X8]
C158  100n  C-5X8@2  [C-5-2X8]
C159  100n  C-5X8@2  [C-5-2X8]
C160  100n  C-5X8@2  [C-5-2X8]
C161  100n  C-5X8@2  [C-5-2X8]
C162  22  C-5X8@2  [C-5-2X8]
C163  22  C-5X8@2  [C-5-2X8]
C212  220M  EC-2/5@2  [EC-5]
C213  22M  EC-2/5  [EC-2/5]
C214  22M  EC-2/5  [EC-2/5]
C215  2M2  EC-2/5  [EC-2/5]
C216  2M2  EC-2/5  [EC-2/5]
C217  2M2  EC-2/5  [EC-2/5]
C218  2M2  EC-2/5  [EC-2/5]
C219  2M2  EC-2/5  [EC-2/5]
D1  5V6  BZV@2  [D-10]
D2  LEDG  LED3  [LED3]
D3  LEDR  LED3  [LED3]
JP1  JTAG  PINHD-2X5  [2X05]
JP2  ISP  PINHD-2X3  [2X03]
K14  KLIC  ML6  [ML6]
K15  PSH02-03W  [PSH02-03]
K16  PSH02-02W  [PSH02-02]
K17  PSH02-02W  [PSH02-02]
K18  PSH02-02W  [PSH02-02]
K19  PWR  ML06  [ML06]
K20  PWR  ML06  [ML06]
K21  RS232  DB9F/90  [D-09F/90]
Q1  14.745MHz  XTAL/S  [QS]
R12  10k  R-10-0,8@2  [R-7,5]
R13  1k  RES-1206@2  [R-7,5]
R14  1k  RES-1206@2  [R-7,5]
R15  2k2  RES-1206@2  [R-7,5]
R16  120  RES-1206@2  [R-7,5]
R17  2k2  RES-1206@2  [R-7,5]
R18  1k  R-10-0,8@2  [R-7,5]
R19  1k  R-10-0,8@2  [R-7,5]
R20  4k7  RES-1206@2  [R-7,5]
R21  4k7  RES-1206@2  [R-7,5]
U156  MEGA162  [DIL40]
U157  74HC138  74AC138  [DIL16]
U158  74HC138  74AC138  [DIL16]
U159  SP485  MAX1483@2  [DIL-08]
U160  24C64  ST24C16DM6@2  [DIL-08]
U161  MAX232  MAX232@2  [DIL16@2]

### Nets
A0: U156.12(PD2/INT0) ; also sheet 1,2,3
A1: U156.13(PD3/INT1) ; also sheet 1,2,3
A2: U156.14(PD4/TOSC1) ; also sheet 1,2,3
A3: U156.15(PD5/TOSC2) U157.1(A) U158.1(A)
A4: U156.16(PD6/!WR) U157.2(B) U158.2(B)
A5: U156.17(PD7/!RD) U157.3(C) U158.3(C)
D0: U156.39(PA0/AD0/I0) ; also sheet 1,2,3
D1: U156.38(PA1/AD1/I1) ; also sheet 1,2,3
D2: U156.37(PA2/AD2/I2) ; also sheet 1,2,3
D3: U156.36(PA3/AD3/I3) ; also sheet 1,2,3
D4: U156.35(PA4/AD4/I4) ; also sheet 1,2,3
D5: U156.34(PA5/AD5/I5) ; also sheet 1,2,3
D6: U156.33(PA6/AD6/I6) ; also sheet 1,2,3
D7: U156.32(PA7/AD7/I7) ; also sheet 1,2,3
E0: U157.15(!Y0) ; also sheet 1
E1: U157.14(!Y1) ; also sheet 1
E2: U157.13(!Y2) ; also sheet 1
E3: U157.12(!Y3) ; also sheet 1
E8: U158.15(!Y0) ; also sheet 2
E9: U158.14(!Y1) ; also sheet 2
E10: U158.13(!Y2) ; also sheet 2
E12: U158.11(!Y4) ; also sheet 3
E13: U158.10(!Y5) ; also sheet 3
E14: U158.9(!Y6) ; also sheet 3
E15: U158.7(!Y7) ; also sheet 3
GND: C156.1 C157.1 C158.1 C159.1 C160.1 C161.1 C162.1 C163.1 C212.1 C213.1 C214.1 C215.1 C218.2 C219.1 D1.2(A) JP1.2 JP2.6 K14.2 K14.4 K14.6 K15.2 K16.2 K17.2 K18.2 K19.2 K19.4 K19.6 K20.2 K20.4 K20.6 K21.5 R17.1 U156.20(GND) U159.5(GND) U160.1(WPE) U160.2(PB0) U160.3(PB1) U160.4(GND) U160.7(MODE) U161.15(GND) ; also sheet 1,2,3
IL: U156.21(PC0/A8) U157.4(!G2A) U157.5(!G2B) ; also sheet 1
N$1252: C162.2 Q1.2 U156.19(XTAL1)
N$1253: C163.2 Q1.1 U156.18(XTAL2)
N$1254: C215.2 JP1.6 JP2.5 R12.2 U156.9(!RESET)
N$1255: K14.1 U156.31(PE0/ICP1)
N$1256: K14.3 U156.30(PE1/ALE)
N$1257: K14.5 U156.29(PE2/OC1B)
N$1258: JP1.1 U156.25(PC4/A12TCK)
N$1259: R13.2 U157.6(G1)
N$1260: R14.2 U158.6(G1)
N$1261: JP1.3 U156.27(PC6/A14TD0)
N$1262: JP1.5 U156.26(PC5/A13TMS)
N$1263: JP1.9 U156.28(PC7/A15TDI)
N$1264: K15.1 R15.1 R16.2 U159.6(A)
N$1265: K21.3 U161.13(R1IN)
N$1266: R20.2 U156.2(PB1/OC2/T1) U160.5(SDA)
N$1267: JP2.4 U156.6(PB5/MOSI)
N$1268: JP2.1 U156.7(PB6/MISO)
N$1269: JP2.3 U156.8(PB7/SCK)
N$1270: R21.2 U156.1(PB0/OC0/T0) U160.6(SCL)
N$1271: U156.3(PB2/RXD1) U159.1(RO)
N$1272: U156.4(PB3/TXD1) U159.4(DI)
N$1273: U156.5(PB4/!SS) U159.2(/RE) U159.3(DE)
N$1274: K21.1 K21.4 K21.6
N$1275: K15.3 R16.1 R17.2 U159.7(B)
N$1277: K21.7 K21.8
N$1278: U156.10(PD0/RXD0) U161.12(R1OUT)
N$1279: U156.11(PD1/TXD0) U161.11(T1IN)
N$1280: C216.2 U161.1(C1+)
N$1281: C217.2 U161.4(C2+)
N$1282: C219.2 U161.2(V+)
N$1283: C216.1 U161.3(C1-)
N$1284: C217.1 U161.5(C2-)
N$1285: C218.1 U161.6(V-)
N$1286: D2.A R18.2
N$1287: D3.A R19.2
N$1288: K21.2 U161.14(T1OUT)
N$1289: D2.K U156.23(PC2/A10)
N$1290: D3.K U156.24(PC3/A11)
OL: U156.22(PC1/A9) U158.4(!G2A) U158.5(!G2B)
VCC: C156.2 C157.2 C158.2 C159.2 C160.2 C161.2 C212.2 C213.2 C214.2 D1.1(K) JP1.4 JP2.2 K16.1 K17.1 K18.1 K19.1 K19.3 K19.5 K20.1 K20.3 K20.5 R12.1 R13.1 R14.1 R15.2 R18.1 R19.1 R20.1 R21.1 U156.40(VCC) U159.8(VCC) U160.8(VCC) U161.16(VCC) ; also sheet 1,2,3
Unconnected: JP1.7 JP1.8 JP1.10 K21.9 U157.7(!Y7) U157.9(!Y6) U157.10(!Y5) U157.11(!Y4) U158.12(!Y3) U161.7(T2OUT) U161.8(R2IN) U161.9(R2OUT) U161.10(T2IN)

### Buses
D[0..7]
A[0..5],E[0..15],IL,OL

### Notes on the sheet
- NAP
- NAP
- NAP
- NAP
- NAP
- NAP
- RS485
- RS485
- RS485
- REJSTRIKY - RIZENI

## Power pins joined to a net without a drawn wire
GND: IC34.8(GND) IC35.8(GND) IC37.10(GND) IC40.10(GND) IC41.10(GND) IC43.10(GND) IC45.10(GND) IC47.10(GND) IC49.10(GND) IC51.10(GND) IC53.8(GND) IC54.8(GND) U54.10(GND) U55.10(GND) U56.10(GND) U57.10(GND) U58.10(GND) U59.10(GND) U60.10(GND) U61.10(GND) U62.8(GND) U71.10(GND) U72.10(GND) U73.10(GND) U74.10(GND) U75.10(GND) U76.10(GND) U77.10(GND) U78.10(GND) U79.8(GND) U88.10(GND) U89.10(GND) U90.10(GND) U91.10(GND) U92.10(GND) U93.10(GND) U94.10(GND) U95.10(GND) U96.8(GND) U105.10(GND) U106.10(GND) U107.10(GND) U108.10(GND) U109.10(GND) U110.10(GND) U111.10(GND) U112.10(GND) U113.8(GND) U122.10(GND) U123.10(GND) U124.10(GND) U125.10(GND) U126.10(GND) U127.10(GND) U128.10(GND) U129.10(GND) U130.8(GND) U139.10(GND) U140.10(GND) U141.10(GND) U142.10(GND) U143.10(GND) U144.10(GND) U145.10(GND) U146.10(GND) U147.8(GND) U157.8(GND) U158.8(GND)
VCC: IC35.16(VCC) IC37.20(VCC) IC40.20(VCC) IC41.20(VCC) IC43.20(VCC) IC45.20(VCC) IC47.20(VCC) IC49.20(VCC) IC51.20(VCC) IC53.16(VCC) IC54.16(VCC) U54.20(VCC) U55.20(VCC) U56.20(VCC) U57.20(VCC) U58.20(VCC) U59.20(VCC) U60.20(VCC) U61.20(VCC) U62.16(VCC) U71.20(VCC) U72.20(VCC) U73.20(VCC) U74.20(VCC) U75.20(VCC) U76.20(VCC) U77.20(VCC) U78.20(VCC) U79.16(VCC) U88.20(VCC) U89.20(VCC) U90.20(VCC) U91.20(VCC) U92.20(VCC) U93.20(VCC) U94.20(VCC) U95.20(VCC) U96.16(VCC) U105.20(VCC) U106.20(VCC) U107.20(VCC) U108.20(VCC) U109.20(VCC) U110.20(VCC) U111.20(VCC) U112.20(VCC) U113.16(VCC) U122.20(VCC) U123.20(VCC) U124.20(VCC) U125.20(VCC) U126.20(VCC) U127.20(VCC) U128.20(VCC) U129.20(VCC) U130.16(VCC) U139.20(VCC) U140.20(VCC) U141.20(VCC) U142.20(VCC) U143.20(VCC) U144.20(VCC) U145.20(VCC) U146.20(VCC) U147.16(VCC) U157.16(VCC) U158.16(VCC)

## Library data of the parts
C1-C63 = .rcl:C-EU: CAPACITOR, European symbol
C88-C96 C105-C113 C122-C130 C139-C147 C156-C163 = AUTOMAT:C-5X8@2
C204-C211 C213-C219 = RIZENI:EC-2/5
C212 = RIZENI:EC-2/5@2
D1 = Zdis:BZV@2
D2 D3 = led:LED3
IC1-IC8 IC10-IC33 = 74xx-eu:74*573: 8-bit D latch BUS DRIVER
IC9 IC34-IC36 IC53 IC54 = 74xx-eu:74*138: 3-line to 8-line DECODER/DEMULTIPLEXER
IC37 IC40 IC41 IC43 IC45 IC47 IC49 IC51 = 74xx-eu:74*574: 8-bit D type FLIP FLOP bus driver
IC38 IC39 IC42 IC44 IC46 IC48 IC50 IC52 IC55 IC56 = uln-udn:ULN2003A: DRIVER ARRAY
JP1 = pinhead:PINHD-2X5: PIN HEADER
JP2 = pinhead:PINHD-2X3: PIN HEADER
K1-K3 K6-K11 = kac:KON64
K4 K5 K12 K13 = kac:KON34
K14 = con-ml:ML6: HARTING; OC_FARNELL: unknown; OC_NEWARK: unknown
K15 = kac:PSH02-03W
K16-K18 = kac:PSH02-02W
K19 K20 = con-ml:ML06
K21 = CONNECT:DB9F/90
Q1 = special:XTAL/S: CRYSTAL
R1-R3 R5-R7 R69 = .rcl:R-EU_: RESISTOR, European symbol
R4 R22-R68 R70-R85 = Panasonic-EXB-ERJ:EXB38V: Chip Resistor Array; MPN: EXB38V473JV; OC_FARNELL: 2060111; OC_NEWARK: 65T9105; PACKAGE: 0603; POWERRATING: 0.063 W/element; SUPPLIER: PANASONIC; TOLERANCE: ±5 %
R8-R12 R18 R19 = AUTOMAT:R-10-0,8@2
R13-R17 R20 R21 = RIZENI:RES-1206@2
SJ1-SJ4 = jumper:SJ2W: SMD solder JUMPER
U54-U61 U71-U78 U88-U95 U105-U112 U122-U129 U139-U146 = CENTRALA:74AC574@2
U62 U79 U96 U113 U130 U147 U157 U158 = CENTRALA:74AC138
U63-U70 U80-U87 U97-U104 U114-U121 U131-U138 U148-U155 = RIZENI:TD62783F@2
U156 = kac:MEGA162
U159 = Zic:MAX1483@2
U160 = Zic:ST24C16DM6@2
U161 = maxim:MAX232@2